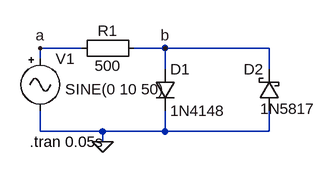
[diagram p0: schematic clipper_diod_sim.asc]
clipper_diod_sim.asc, the LTspice schematic file:
Version 4
SHEET 1 880 680
WIRE 16 208 -48 208
WIRE 144 208 96 208
WIRE 304 208 144 208
WIRE -48 224 -48 208
WIRE 144 240 144 208
WIRE 304 240 304 208
WIRE -48 336 -48 304
WIRE 48 336 -48 336
WIRE 144 336 144 304
WIRE 144 336 48 336
WIRE 304 336 304 304
WIRE 304 336 144 336
WIRE 48 352 48 336
FLAG -48 208 a
FLAG 144 208 b
FLAG 48 352 0
SYMBOL diode 128 240 R0
SYMATTR InstName D1
SYMATTR Value 1N4148
SYMBOL Misc\\signal -48 208 R0
WINDOW 123 0 0 Left 2
WINDOW 39 0 0 Left 2
WINDOW 3 38 63 Left 2
SYMATTR Value SINE(0 10 50)
SYMATTR InstName V1
SYMBOL Misc\\EuropeanResistor 112 192 R90
WINDOW 0 5 56 VBottom 2
WINDOW 3 27 56 VTop 2
SYMATTR InstName R1
SYMATTR Value 500
SYMBOL schottky 320 304 R180
WINDOW 0 24 64 Left 2
WINDOW 3 -55 3 Left 2
SYMATTR InstName D2
SYMATTR Value 1N5817
SYMATTR Description Diode
SYMATTR Type diode
TEXT -64 352 Left 2 !.tran 0.05s

The netlist it stands for:
* clipper_diod_sim.asc
D1 b 0 1N4148
V1 a 0 SINE(0 10 50)
R1 b a 500
D2 0 b 1N5817
.model D D
.lib standard.dio
.tran 0.05s
.backanno
.end